# EAGLE schematic untitled (EAGLE 8.6.3)
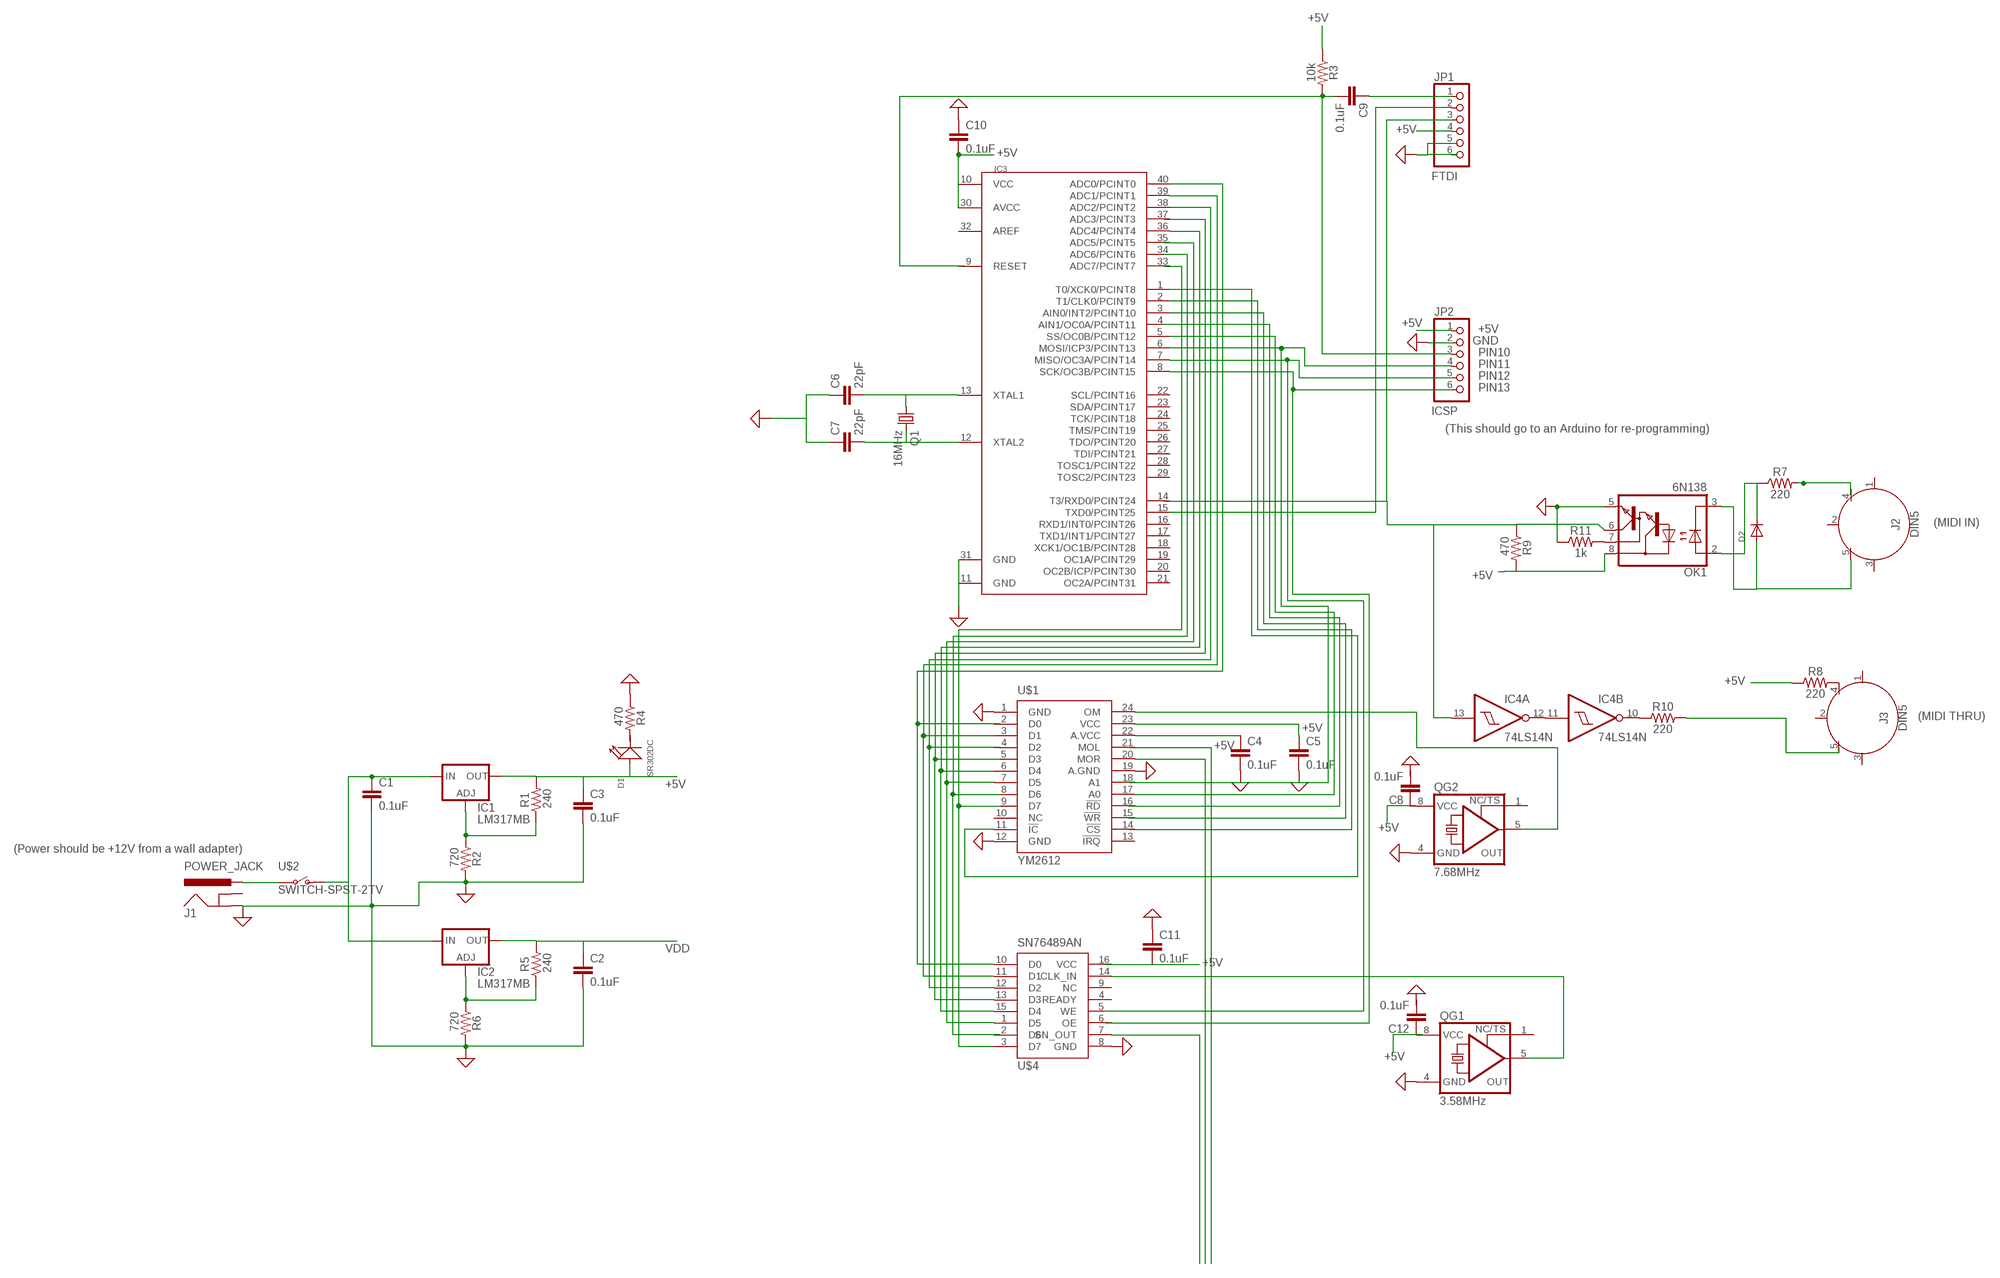
[diagram p0: schematic, sheet 1]

## Parts
C1  0.1uF  .1UF-CERCAP-08390  [0402-CAP]
C2  0.1uF  .1UF-CERCAP-08390  [0402-CAP]
C3  0.1uF  .1UF-CERCAP-08390  [0402-CAP]
C4  0.1uF  .1UF-CERCAP-08390  [0402-CAP]
C5  0.1uF  .1UF-CERCAP-08390  [0402-CAP]
C6  22pF  .1UF-CERCAP-08390  [0402-CAP]
C7  22pF  .1UF-CERCAP-08390  [0402-CAP]
C8  0.1uF  .1UF-CERCAP-08390  [0402-CAP]
C9  0.1uF  .1UF-CERCAP-08390  [0402-CAP]
C10  0.1uF  .1UF-CERCAP-08390  [0402-CAP]
C11  0.1uF  .1UF-CERCAP-08390  [0402-CAP]
C12  0.1uF  .1UF-CERCAP-08390  [0402-CAP]
D1  SR302DC  DIP-LED-RED-RED(2P-D3MM)  [LED2-2.54-D3.0MM]
D2  DIODEDO-1N4148  [DO-1N4148]
IC1  LM317MB  [TO220L1]
IC2  LM317MB  [TO220L1]
IC3  MEGA1284P  [DIL40]
IC4  74LS14N  [DIL14]
J1  POWER_JACK  [POWER_JACK_PTH]
J2  DIN5  [DIN5-RA-PTH]
J3  DIN5  [DIN5-RA-PTH]
JP1  PINHD-1X6  [1X06]
JP2  PINHD-1X6  [1X06]
OK1  6N138  [DIL08]
Q1  16MHz  CRYSTALHC18U-H  [HC18U-H]
QG1  3.58MHz  XO-8  [DIL08S]
QG2  7.68MHz  XO-8  [DIL08S]
R1  240  RESISTORAXIAL-0.3  [AXIAL-0.3]
R2  720  RESISTORAXIAL-0.3  [AXIAL-0.3]
R3  10k  RESISTORAXIAL-0.3  [AXIAL-0.3]
R4  470  RESISTORAXIAL-0.3  [AXIAL-0.3]
R5  240  RESISTORAXIAL-0.3  [AXIAL-0.3]
R6  720  RESISTORAXIAL-0.3  [AXIAL-0.3]
R7  220  RESISTORAXIAL-0.3  [AXIAL-0.3]
R8  220  RESISTORAXIAL-0.3  [AXIAL-0.3]
R9  470  RESISTORAXIAL-0.3  [AXIAL-0.3]
R10  220  RESISTORAXIAL-0.3  [AXIAL-0.3]
R11  1k  RESISTORAXIAL-0.3  [AXIAL-0.3]
U$1  YM2612  [DIP24]
U$2  SWITCH-SPST-2TV  [SWITCH-SPST-VERTICAL]
U$4  SN76489AN  [DIP16]

## Nets
+5V: C3.1 C4.1 C5.1 C10.2 C11.2 IC1.2(OUT) IC3.10(VCC) IC3.30(AVCC) JP1.4 JP2.1 OK1.8(VCC) R1.P$2 R3.P$1 R8.P$1 R9.P$2 U$1.22(A.VCC) U$1.23(VCC)
GND: C1.2 C2.2 C3.2 C4.2 C5.2 C6.1 C7.1 C10.1 C11.1 IC3.11(GND) IC3.31(GND) J1.GND JP2.2 OK1.5(GND) QG1.4(GND) QG2.4(GND) R2.P$2 R4.P$1 R6.P$2 R11.P$1 U$1.1(GND) U$1.12(GND) U$1.19(A.GND) U$4.8(GND) ; supply symbol labelled SUP
N$1: C1.1 IC1.3(IN) IC2.3(IN) U$2.1(O)
N$2: C6.2 IC3.13(XTAL1) Q1.1
N$3: IC1.1(ADJ) R1.P$1 R2.P$1
N$4: C7.2 IC3.12(XTAL2) Q1.2
N$5: J1.PWR U$2.2(P)
N$6: C9.2 JP2.3 R3.P$2
N$7: C9.1 JP1.1
N$8: IC2.1(ADJ) R5.P$1 R6.P$1
N$9: IC3.15(TXD0/PCINT25) JP1.2
N$10: IC4.13(A:I) JP1.3 OK1.6(VO) R9.P$1
N$11: IC3.7(MISO/OC3A/PCINT14) JP2.5
N$12: IC3.6(MOSI/ICP3/PCINT13) JP2.4
N$13: IC3.8(SCK/OC3B/PCINT15) JP2.6
N$14: U$4.3(D7)
N$16: U$1.7(D5) U$4.1(D5)
N$17: IC3.36(ADC4/PCINT4) U$1.6(D4) U$4.15(D4)
N$18: U$4.13(D3)
N$19: IC3.38(ADC2/PCINT2) U$4.12(D2)
N$20: IC3.39(ADC1/PCINT1) U$1.3(D1) U$4.11(D1)
N$21: IC3.40(ADC0/PCINT0) U$4.10(D0)
N$22: IC3.1(T0/XCK0/PCINT8) U$1.11(!IC!)
N$23: IC3.2(T1/CLK0/PCINT9)
N$25: IC3.5(SS/OC0B/PCINT12) U$1.17(A0)
N$27: R7.P$2
N$28: D2.A J2.5 OK1.3(C)
N$29: D2.C OK1.2(A) R7.P$1
N$30: OK1.7(VB) R11.P$2
N$31: IC4.11(B:I) IC4.12(A:O)
N$32: IC4.10(B:O) R10.P$1
N$33: C8.1 QG2.8(VCC)
N$34: J3.5 R10.P$2
N$35: U$1.24(OM)
N$36: J3.4 R8.P$2
N$38: C12.1 QG1.8(VCC)
N$39: U$4.14(CLK_IN)
N$40: U$1.20(MOR)
N$41: U$4.7(SN_OUT)
VDD: C2.1 IC2.2(OUT) R5.P$2
Unconnected: C8.2 C12.2 D1.A(+) D1.K(-) IC3.3(AIN0/INT2/PCINT10) IC3.4(AIN1/OC0A/PCINT11) IC3.9(RESET) IC3.14(T3/RXD0/PCINT24) IC3.16(RXD1/INT0/PCINT26) IC3.17(TXD1/INT1/PCINT27) IC3.18(XCK1/OC1B/PCINT28) IC3.19(OC1A/PCINT29) IC3.20(OC2B/ICP/PCINT30) IC3.21(OC2A/PCINT31) IC3.22(SCL/PCINT16) IC3.23(SDA/PCINT17) IC3.24(TCK/PCINT18) IC3.25(TMS/PCINT19) IC3.26(TDO/PCINT20) IC3.27(TDI/PCINT21) IC3.28(TOSC1/PCINT22) IC3.29(TOSC2/PCINT23) IC3.32(AREF) IC3.33(ADC7/PCINT7) IC3.34(ADC6/PCINT6) IC3.35(ADC5/PCINT5) IC3.37(ADC3/PCINT3) IC4.1(D:I) IC4.2(D:O) IC4.3(E:I) IC4.4(E:O) IC4.5(F:I) IC4.6(F:O) IC4.8(C:O) IC4.9(C:I) J1.GNDBREAK J2.1 J2.2 J2.3 J2.4 J3.1 J3.2 J3.3 JP1.5 JP1.6 QG1.1(TS) QG1.5(OUT) QG2.1(TS) QG2.5(OUT) R4.P$2 U$1.2(D0) U$1.4(D2) U$1.5(D3) U$1.8(D6) U$1.9(D7) U$1.10(NC) U$1.13(!IRQ!) U$1.14(!CS!) U$1.15(!WR!) U$1.16(!RD!) U$1.18(A1) U$1.21(MOL) U$4.2(D6) U$4.4(READY) U$4.5(WE) U$4.6(OE) U$4.9(NC) U$4.16(VCC)

## Notes on the sheet
- +5V
- +5V
- +5V
- FTDI
- +5V
- +5V
- GND
- PIN10
- PIN11
- PIN12
- PIN13
- ICSP
- (This should go to an Arduino for re-programming)
- (MIDI IN)
- +5V
- +5V
- (MIDI THRU)
- +5V
- +5V
- +5V
- +5V
- (Power should be +12V from a wall adapter)
- VDD
- +5V
- +5V

## Power pins joined to a net without a drawn wire
GND: IC4.7(P:GND)
VCC: IC4.14(P:VCC)

## Library data of the parts
C1-C5 C8-C12 = SparkFun-Retired:.1UF-CER: .1uF ceramic SMT CAP-00810- 25V +80%/-20% (0603) CAP-08390- 100V 10% (0603) CAP-08604- 25V 5% (0603); PROD_ID: CAP-08390
C6 C7 = SparkFun-Retired:.1UF-CER: .1uF ceramic SMT CAP-00810- 25V +80%/-20% (0603) CAP-08390- 100V 10% (0603) CAP-08604- 25V 5% (0603); PROD_ID: CAP-08390; VALUE: 0.1uF
D1 = Seeed-LED:DIP-LED-RED-RED(2P-D3MM): 304090041; MPN: SR302DC
D2 = adafruit:DIODE: Diode SMADIODE - SMA Surface Mount Package 20V 1A Schottky Diode Digikey: 641-1014-6-ND DO-1N4148 - Through Hole Small Current Diode SOD-123 20V 1 A (.5mV Vf) Schottky Diode - Digikey: MBRX120TPMSCT-ND SOD-323 10V 570mA (.38mV Vf, 3ns) Schottky Diode - Digikey: ZLLS410CT-ND SOD-523 30V 30mA Schottky Diode (RB751S-40TE61) - Digikey: RB751S-40TE61CT-ND SOT23-R/W - SOT23 Package (R = Solder Paste/Reflow Ovens, W = Hand-Soldering) BAT54Film 40V 300mA - Digikey: 497-7162-1-ND
IC1 IC2 = v-reg:LM317?*: 500 mA Adjustable Output Positive Voltage Regulator Source: http://www.onsemi.co.jp .. LM317M-D.PDF
IC3 = 1284p:MEGA1284P: Atmel ATmega1284P 8-bit AVR Microcontroller
IC4 = 74xx-us:74*14: Hex schmitt trigger INVERTER
J1 = SparkFun-Connectors:POWER_JACK: Power Jack Connector This is the standard 5.5mm barrel jack for power. The PTH is the most common, proven, reliable, footprint. The Slot footprint only works if the mill layer is transmitted to the PCB fab house so be warned. Here are the connectors we sell at SparkFun: DC Barrel Power Jack/Connector <https://www.sparkfun.com/products/119> (PRT-00119) DC Barrel Power Jack/Connector (SMD) <https://www.sparkfun.com/products/12748> (PRT-12748) DC Barrel Jack Adapter - Breadboard Compatible <https://www.sparkfun.com/products/10811> (PRT-10811) It is used on this SparkFun product (and many, many others): SparkFun RedBoard - Programmed with Arduino <https://www.sparkfun.com/products/12757> (DEV-12757) Also, if you need a mating power supply or connector, please check these out: Wall Adapter Power Supply - 9VDC 650mA <https://www.sparkfun.com/products/298> (TOL-00298) DC Barrel Jack Adapter - Male <https://www.sparkfun.com/products/10287> (PRT-10287); PROD_ID: CONN-08197
J2 J3 = SparkFun-Connectors:DIN5: DIN5 Connector - Female Right Angle (frequently used as a MIDI Jack connector) This type of connector and cable is frequently used for transmitting midi data (musical instrument digital interface). It is what you usually see on a keyboard or set of electronic drums. Learn more here <https://en.wikipedia.org/wiki/MIDI>. For more information on the pinout and electrical specifications of MIDI communications, please see the following resource: https://www.midi.org/specifications/item/midi-din-electrical-specification Here is the connector we sell at SparkFun: MIDI Connector - Female Right Angle <https://www.sparkfun.com/products/9536> (PRT-09536) Datasheet <hhttp://www.sparkfun.com/datasheets/Prototyping/Connectors/MIDI-RA.pdf> It is used on this SparkFun product: SparkFun MIDI Shield <https://www.sparkfun.com/products/12898> (DEV-12898); PROD_ID: CONN-09481
JP1 JP2 = adafruit:PINHD-1X6: PIN HEADER
OK1 = optocoupler:6N138: MOTOROLA OPTO COUPLER; MF: VISHAY/TELEFUNKEN; MPN: 6N138; OC_FARNELL: 9860150; OC_NEWARK: 35K5294
Q1 = adafruit:CRYSTAL: CRYSTAL; OC_FARNELL: unknown; OC_NEWARK: unknown
QG1 QG2 = crystal:XO-: CRYSTAL; OC_FARNELL: unknown; OC_NEWARK: unknown
R1-R11 = SparkFun-Resistors:RESISTOR: Generic Resistor Package
U$1 = YM2612:YM2612: YM26126 - Yamaha FM Sound Synthesis chip
U$2 = SparkFun-Retired:SWITCH-SPST-2
U$4 = YM2612:SN76489AN